# Altium schematic sheet TTraceWindow.schDOC
size A3; Organization: Altium Limited; Address1: L3, 12a Rodborough Rd; Address2: Frenchs Forest; Address3: NSW; Address4: Australia 2086; DocumentNumber: 14; SheetNumber: 14; SheetTotal: 22
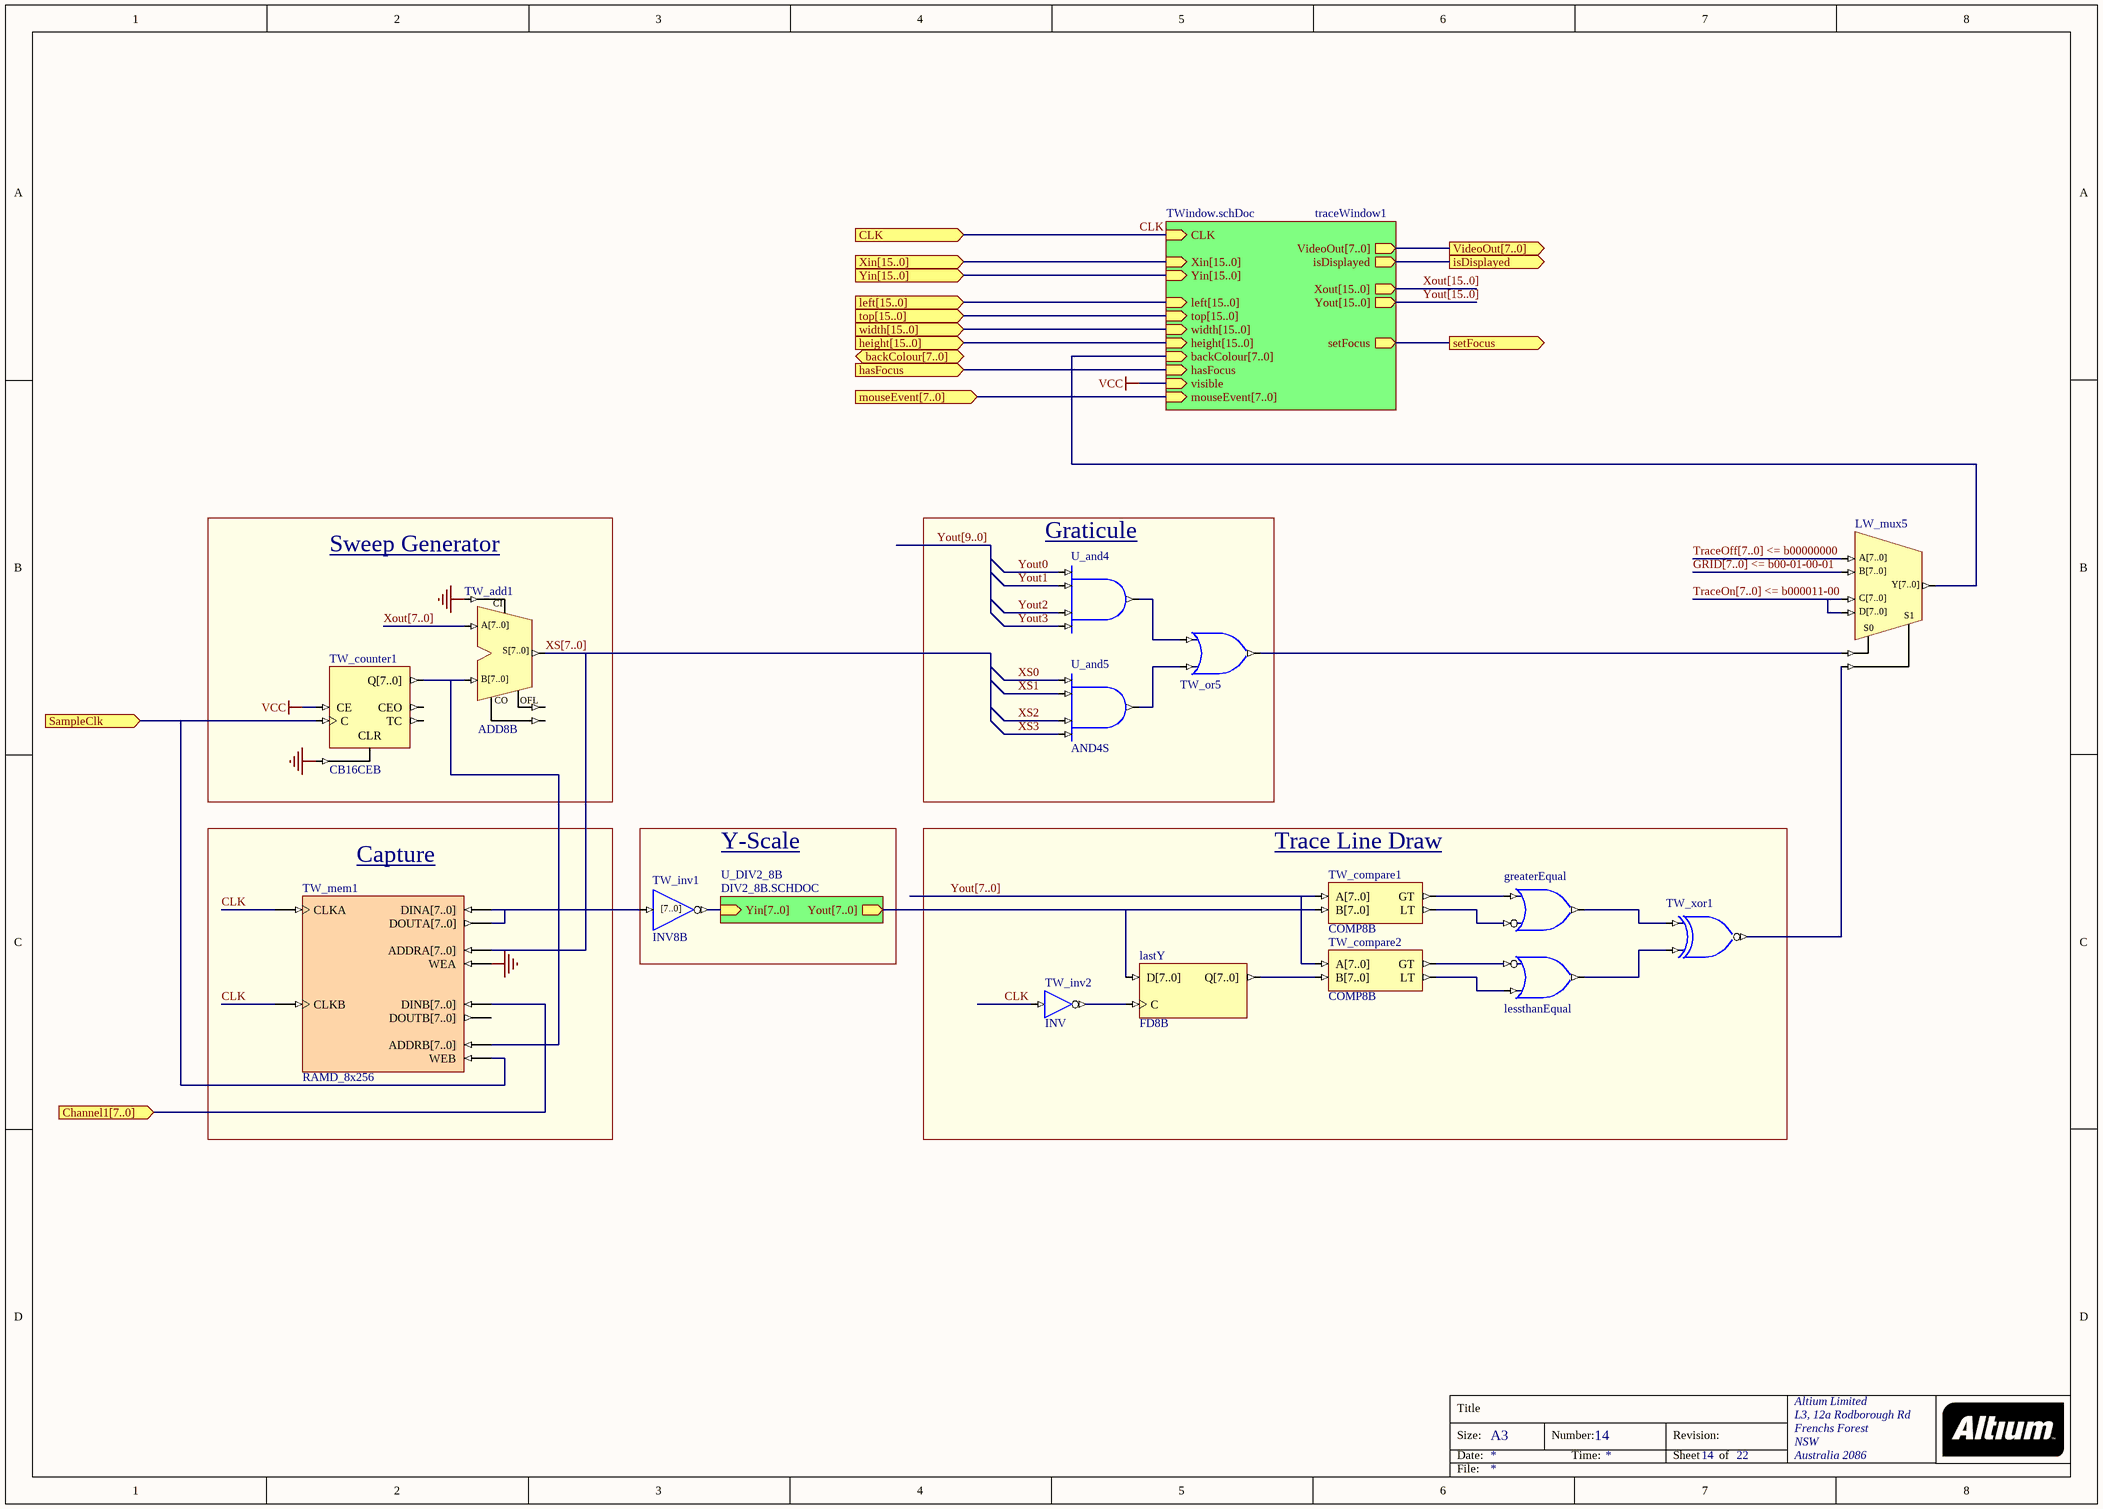
[diagram p0: TTraceWindow.schDOC]

## Parts
greaterEqual  OR2N1S  (value not drawn)
lastY  FD8B
lessthanEqual  OR2N1S  (value not drawn)
LW_mux5  M8_B2B1  (value not drawn)
TW_add1  ADD8B
TW_compare1  COMP8B
TW_compare2  COMP8B
TW_counter1  CB16CEB
TW_inv1  INV8B
TW_inv2  INV
TW_mem1  RAMD_8x256
TW_or5  OR2S  (value not drawn)
TW_xor1  OR2N1S  (value not drawn)
U_and4  AND4S  (value not drawn)
U_and5  AND4S

## Blocks framed on the sheet
Sweep Generator: TW_add1 TW_counter1
Graticule: TW_or5 U_and4 U_and5
Capture: TW_mem1
Y-Scale: TW_inv1
Trace Line Draw: greaterEqual lastY lessthanEqual TW_compare1 TW_compare2 TW_inv2 TW_xor1

## Sub-sheets
traceWindow1 = TWindow.schDoc: CLK (in), VideoOut[7..0] (out), Xin[15..0] (in), Yin[15..0] (in), top[15..0] (in), width[15..0] (in), height[15..0] (in), left[15..0] (in), Xout[15..0] (out), Yout[15..0] (out), backColour[7..0] (in), isDisplayed (out), visible (in), hasFocus (in), setFocus (out), mouseEvent[7..0] (in)
U_DIV2_8B = DIV2_8B.SCHDOC: Yin[7..0] (in), Yout[7..0] (out)

## Ports
backColour[7..0] (in), Channel1[7..0] (in), CLK (in), hasFocus (in), height[15..0] (in), isDisplayed (out), left[15..0] (in), mouseEvent[7..0] (in), SampleClk (in), setFocus (out), top[15..0] (in), VideoOut[7..0] (out), width[15..0] (in), Xin[15..0] (in), Yin[15..0] (in)

## Nets
GND: TW_add1.CI TW_counter1.CLR TW_mem1.WEA
VCC: TW_counter1.CE ; sheet traceWindow1/visible
Channel1[7..0]: TW_mem1.DINB[7..0] ; port Channel1[7..0]
CLK: TW_inv2.I TW_mem1.CLKA TW_mem1.CLKB ; port CLK, sheet traceWindow1/CLK
GRID[7..0] <= b00-01-00-01: LW_mux5.B[7..0]
hasFocus: port hasFocus, sheet traceWindow1/hasFocus
isDisplayed: port isDisplayed, sheet traceWindow1/isDisplayed
SampleClk: TW_counter1.C TW_mem1.WEB ; port SampleClk
setFocus: port setFocus, sheet traceWindow1/setFocus
TraceOff[7..0] <= b00000000: LW_mux5.A[7..0]
TraceOn[7..0] <= b000011-00: LW_mux5.C[7..0] LW_mux5.D[7..0]
Xout[7..0]: TW_add1.A[7..0]
XS0: U_and5.I0
XS1: U_and5.I1
XS2: U_and5.I2
XS3: U_and5.I3
XS[7..0]: TW_add1.S[7..0] TW_mem1.ADDRA[7..0]
Yout0: U_and4.I0
Yout1: U_and4.I1
Yout2: U_and4.I2
Yout3: U_and4.I3
Yout[7..0]: TW_compare1.A[7..0] TW_compare2.A[7..0]
NetgreaterEqual_I0: greaterEqual.I0 TW_compare1.LT
NetgreaterEqual_I1: greaterEqual.I1 TW_compare1.GT
NetgreaterEqual_O: greaterEqual.O TW_xor1.I0
NetlastY_C: lastY.C TW_inv2.O
NetlastY_D[7..0]: lastY.D[7..0] TW_compare1.B[7..0] ; sheet U_DIV2_8B/Yout[7..0]
NetlastY_Q[7..0]: lastY.Q[7..0] TW_compare2.B[7..0]
NetlessthanEqual_I0: lessthanEqual.I0 TW_compare2.GT
NetlessthanEqual_I1: lessthanEqual.I1 TW_compare2.LT
NetlessthanEqual_O: lessthanEqual.O TW_xor1.I1
NetLW_mux5_S0: LW_mux5.S0 TW_or5.O
NetLW_mux5_S1: LW_mux5.S1 TW_xor1.O
NetLW_mux5_Y[7..0]: LW_mux5.Y[7..0] ; sheet traceWindow1/backColour[7..0]
NetTW_add1_B[7..0]: TW_add1.B[7..0] TW_counter1.Q[7..0] TW_mem1.ADDRB[7..0]
NetTW_inv1_I[7..0]: TW_inv1.I[7..0] TW_mem1.DINA[7..0] TW_mem1.DOUTA[7..0]
NetTW_inv1_O[7..0]: TW_inv1.O[7..0] ; sheet U_DIV2_8B/Yin[7..0]
NetTW_or5_I0: TW_or5.I0 U_and5.O
NetTW_or5_I1: TW_or5.I1 U_and4.O

Not connected (* = marked no-connect by the designer): TW_add1 CO OFL; TW_counter1 CEO TC; TW_mem1 DOUTB[7..0]

## Buses and harness runs
bus GRID[7..0] <= b00-01-00-01
bus port height[15..0] = sheet traceWindow1/height[15..0]
bus port left[15..0] = sheet traceWindow1/left[15..0]
bus port mouseEvent[7..0] = sheet traceWindow1/mouseEvent[7..0]
bus port top[15..0] = sheet traceWindow1/top[15..0]
bus port VideoOut[7..0] = sheet traceWindow1/VideoOut[7..0]
bus port width[15..0] = sheet traceWindow1/width[15..0]
bus port Xin[15..0] = sheet traceWindow1/Xin[15..0]
bus port Yin[15..0] = sheet traceWindow1/Yin[15..0]
bus TraceOff[7..0] <= b00000000
bus TraceOn[7..0] <= b000011-00
bus Xout[7..0]
bus Xout[15..0] = sheet traceWindow1/Xout[15..0]
bus XS[7..0]
bus Yout[7..0]
bus Yout[9..0]
bus Yout[15..0] = sheet traceWindow1/Yout[15..0]

## Notes on the sheet
- Title
- Size:
- Date:
- A3
- Number:
- Time:
- Revision:
- Sheet
- of
- File:
- (in symbol INV8B) [7..0]

## Library data of the parts
greaterEqual lessthanEqual = OR2N1S: 2-Input OR Gate with Active Low A Input, Single Pin Version; Xilinx Equivalent: OR2B1; ArchiveName: GENERIC; Published: 9-30-2003; Publisher: Altium Limited; Core Revision: 1.00.00
lastY = FD8B: 8-Bit D-Type Flip-Flop, Bus Version; Xilinx Equivalent: FD8; ArchiveName: GENERIC; Published: 9-30-2003; Publisher: Altium Limited; Core Revision: 1.00.00
LW_mux5 = M8_B4B1: 4x8-Bit Bus to 1x8-Bit Bus Multiplexer; ArchiveName: GENERIC; Published: 9-30-2003; Publisher: Altium Limited; Core Revision: 1.00.00
TW_add1 = ADD8B: 8-Bit Cascadable Full Adder with Carry In, Carry Out and Overflows, Bus Version; Xilinx Equivalent: ADD8; ArchiveName: GENERIC; Published: 9-30-2003; Publisher: Altium Limited; Core Revision: 1.00.00
TW_compare1 TW_compare2 = COMPM8B: 8-Bit Magnitude Comparator, Bus Version; Xilinx Equivalent: COMPM8; ArchiveName: GENERIC; Published: 9-30-2003; Publisher: Altium Limited; Core Revision: 1.00.00
TW_counter1 = CB8CEB: 8-Bit Cascadable Binary Counters with Clock Enable and Asynchronous Clear, Bus Version; Xilinx Equivalent: CB8CE; ArchiveName: GENERIC; Published: 9-30-2003; Publisher: Altium Limited; Core Revision: 1.00.00
TW_inv1 = INV8B: 8-Bit Inverter, Bus Version; ArchiveName: GENERIC; Published: 9-30-2003; Publisher: Altium Limited; Core Revision: 1.00.00
TW_inv2 = INV: Inverter; ArchiveName: GENERIC; Published: 9-30-2003; Publisher: Altium Limited; Xilinx Equivalent: INV; Core Revision: 1.00.00
TW_mem1 = RAMD_8x256: Dual Port Random Access Memory; Memory_DepthA: 256; Memory_Type: RAM_DualPortBlock; Memory_WidthA: 8; Memory_ClockEdge: Rising; Nexus_Core: Memory_Program; Published: 13/01/2004; Publisher: Altium Hobart Technology Center; Memory_DepthB: 256; Memory_WidthB: 8
TW_or5 = OR2S: 2-Input OR Gate, Single Pin Version; Xilinx Equivalent: OR2; ArchiveName: GENERIC; Published: 9-30-2003; Publisher: Altium Limited; Core Revision: 1.00.00
TW_xor1 = XNOR2S: 2-Input Exclusive-NOR Gate, Single Pin Version; Xilinx Equivalent: XNOR2; ArchiveName: GENERIC; Published: 9-30-2003; Publisher: Altium Limited; Core Revision: 1.00.00
U_and4 U_and5 = AND4S: 4-Input AND Gate, Single Pin Version; ArchiveName: GENERIC; XilinxEquivalent: AND4; FunctionalClass: Logic Primitive; PortSize: 4; VHDLIB_SIM: GENERIC_LIB; Published: 29-Jan-2004; Publisher: Altium Limited; LastRevisionNo: 1.00.00; HelpURL: CR0118 FPGA Generic Library Guide.pdf#page=113; SubClass: AND; PortStyle: Single Pin Version